# Altium schematic sheet 232收发器.SchDoc
size A4; SheetNumber: 5; SheetTotal: 7
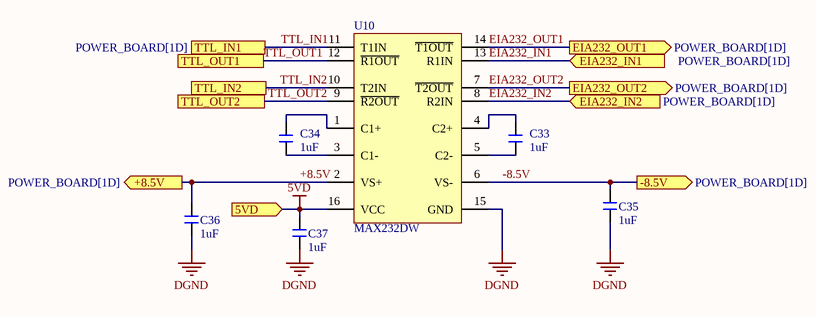
[diagram p0: 232收发器.SchDoc]

## Parts
C33  1uF  [C 0805_L]
C34  1uF  [C 0805_L]
C35  1uF  [C 0805_L]
C36  1uF  [C 0805_L]
C37  1uF  [C 0805_L]
U10  MAX232DW  [DW0016A_N]

## Ports
5VD (in, see POWER_BOARD[1C], CAN收发器[1A]), +8.5V (out, see POWER_BOARD[1D]), -8.5V (out, see POWER_BOARD[1D]), EIA232_IN1 (in, see POWER_BOARD[1D]), EIA232_IN2 (in, see POWER_BOARD[1D]), EIA232_OUT1 (out, see POWER_BOARD[1D]), EIA232_OUT2 (out, see POWER_BOARD[1D]), TTL_IN1 (see POWER_BOARD[1D]), TTL_IN2 (see POWER_BOARD[1D]), TTL_OUT1 (see POWER_BOARD[1D]), TTL_OUT2 (see POWER_BOARD[1D])

## Nets
5VD: C37.2 U10.16(VCC) ; port 5VD
DGND: C35.1 C36.1 C37.1 U10.15(GND)
+8.5V: C36.2 U10.2(VS+) ; port +8.5V
-8.5V: C35.2 U10.6(VS-) ; port -8.5V
EIA232_IN1: U10.13(R1IN) ; port EIA232_IN1
EIA232_IN2: U10.8(R2IN) ; port EIA232_IN2
EIA232_OUT1: U10.14(~{T1OUT}) ; port EIA232_OUT1
EIA232_OUT2: U10.7(~{T2OUT}) ; port EIA232_OUT2
TTL_IN1: U10.11(T1IN) ; port TTL_IN1
TTL_IN2: U10.10(T2IN) ; port TTL_IN2
TTL_OUT1: U10.12(~{R1OUT}) ; port TTL_OUT1
TTL_OUT2: U10.9(~{R2OUT}) ; port TTL_OUT2
NetC33_1: C33.1 U10.5(C2-)
NetC33_2: C33.2 U10.4(C2+)
NetC34_1: C34.1 U10.3(C1-)
NetC34_2: C34.2 U10.1(C1+)

## Library data of the parts
C33-C37 = C: 贴片电容; BOM名称: 无极性贴片电容; 淘宝ID: 封装库来自淘宝 ID：黄晶宝石; 联系售后，技术支持: https://shop463601444.taobao.com; 唯一出售店铺网址: https://shop463601444.taobao.com
U10 = CMP-0299-00141-2: Dual EIA-232 Driver / Receiver, 0 to 70 degC, 16-Pin SOIC (DW), Green (RoHS & no Sb/Br); SubFamily: RS-232; Supply Voltage(s)(V): 5; ICC(Max)(mA): 10; RS-232: TRUE; Drivers Per Package: 2; ESD HBM(kV): +/-2; ComponentLink1Description: Manufacturer URL; PackageDescription: 16-Pin Small Outline Integrated Circuit, 10.3 x 7.5 mm, Pitch 1.27 mm Pitch; PackageVersion: revG, Jan-2011; DatasheetVersion: SLLS047L; Single Supply: TRUE; ComponentLink2URL: http://www.ti.com/general/docs/lit/getliterature.tsp?genericPartNumber=MAX232&fileType=pdf; ComponentLink1URL: www.ti.com; ComponentLink3URL: http://www.ti.com/litv/pdf/msoi003g; ComponentLink2Description: Datasheet; Receivers Per Package: 2; PackageReference: DW0016A; ComponentLink3Description: Package Specification